# Altium schematic sheet [21] - AUDIO.SchDoc
size A3; DocumentNumber: 21; SheetNumber: 21; SheetTotal: 31
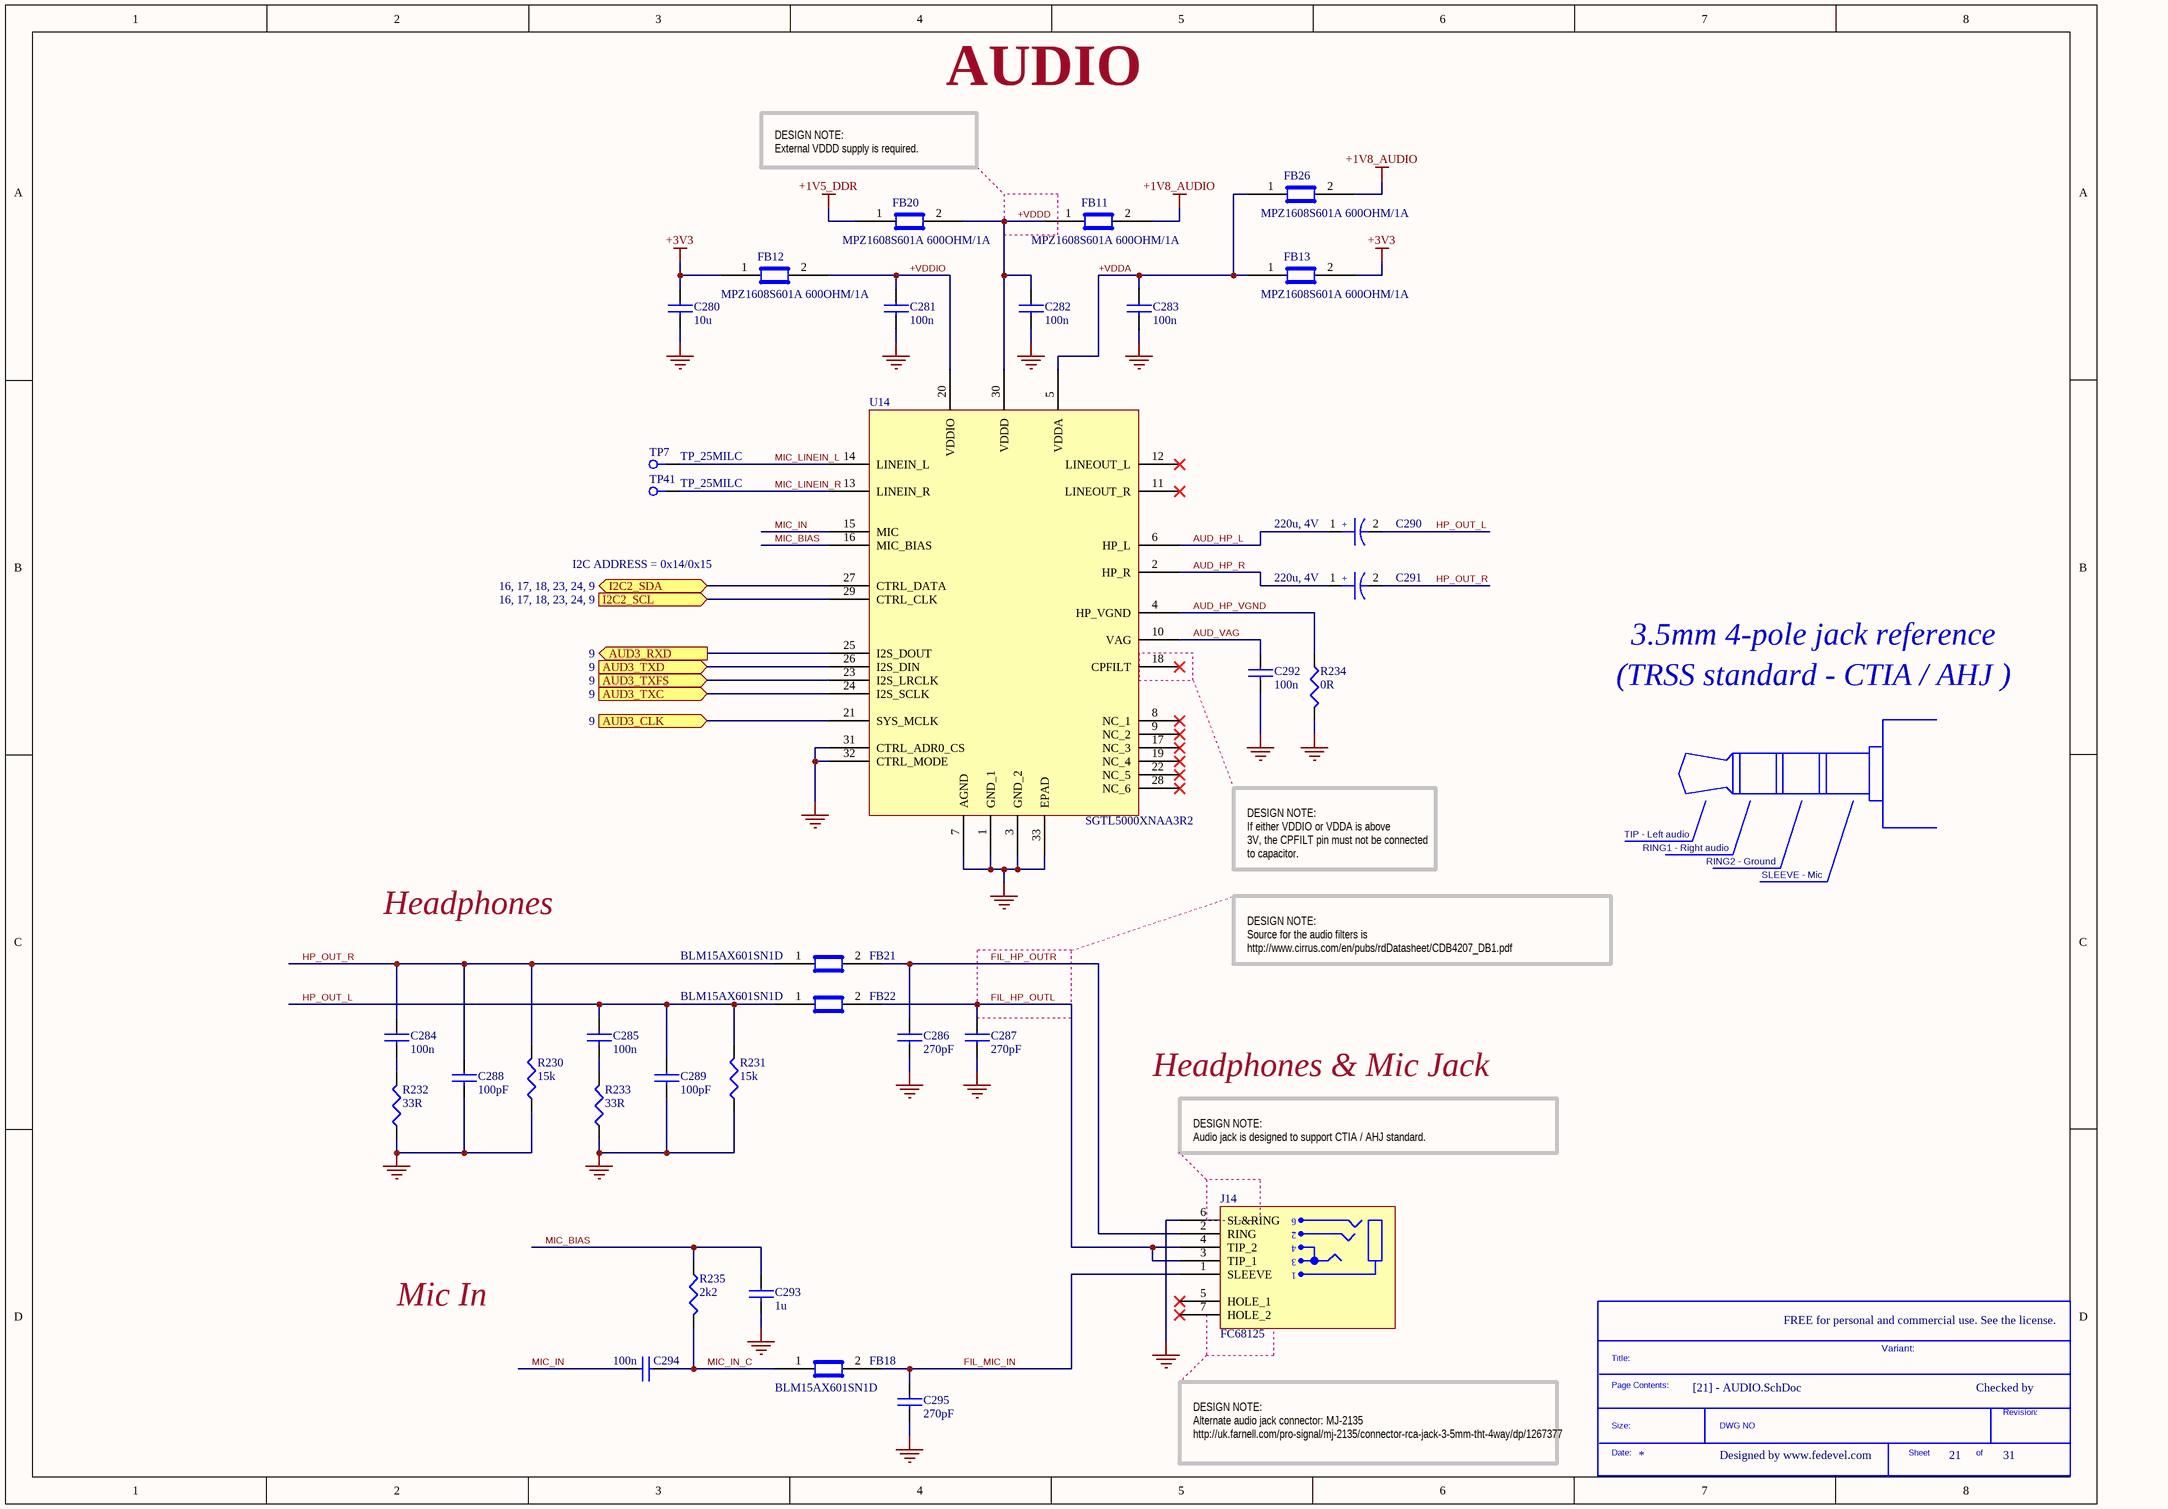
[diagram p0: [21] - AUDIO.SchDoc]

## Parts
*  SDTitleBlock  (value not drawn)  (graphical)
C280  10u  [C0603]
C281  100n  [C0402]
C282  100n  [C0402]
C283  100n  [C0402]
C284  100n  [C0402]
C285  100n  [C0402]
C286  270pF  [C0402]
C287  270pF  [C0402]
C288  100pF  [C0402]
C289  100pF  [C0402]
C290  220u, 4V  [C1206 -  TLN S Case Tantal]
C291  220u, 4V  [C1206 -  TLN S Case Tantal]
C292  100n  [C0402]
C293  1u  [C0402]
C294  100n  [C0402]
C295  270pF  [C0402]
FB11  MPZ1608S601A 600OHM/1A  [C0603]
FB12  MPZ1608S601A 600OHM/1A  [C0603]
FB13  MPZ1608S601A 600OHM/1A  [C0603]
FB18  BLM15AX601SN1D  [C0402]
FB20  MPZ1608S601A 600OHM/1A  [C0603]
FB21  BLM15AX601SN1D  [C0402]
FB22  BLM15AX601SN1D  [C0402]
FB26  MPZ1608S601A 600OHM/1A  [C0603]
J14  FC68125  [FC68125]
R230  15k  [R0402]
R231  15k  [R0402]
R232  33R  [R0402]
R233  33R  [R0402]
R234  0R  [R0402]
R235  2k2  [R0402]
TP7  TP_25MILC  [TP_25C]  (no BOM)
TP41  TP_25MILC  [TP_25C]  (no BOM)
U14  SGTL5000XNAA3R2  [QFN32 5x5x0.85_V1.1]

## Ports
AUD3_CLK (in, see 9), AUD3_RXD (out, see 9), AUD3_TXC (in, see 9), AUD3_TXD (in, see 9), AUD3_TXFS (in, see 9), I2C2_SCL (see 16, 17, 18, 23, 24, 9), I2C2_SDA (bidir, see 16, 17, 18, 23, 24, 9)

## Nets
+1V5_DDR: FB20.1
+1V8_AUDIO: FB11.2 FB26.2
+3V3: C280.1 FB12.1 FB13.2
GND: C280.2 C281.2 C282.2 C283.2 C286.2 C287.2 C288.2 C289.2 C292.2 C293.2 C295.2 J14.6(SL&RING) R230.1 R231.1 R232.1 R233.1 R234.2 U14.1(GND_1) U14.3(GND_2) U14.7(AGND) U14.31(CTRL_ADR0_CS) U14.32(CTRL_MODE) U14.33(EPAD)
+VDDA: C283.1 FB13.1 FB26.1 U14.5(VDDA)
+VDDD: C282.1 FB11.1 FB20.2 U14.30(VDDD)
+VDDIO: C281.1 FB12.2 U14.20(VDDIO)
AUD3_CLK: U14.21(SYS_MCLK) ; port AUD3_CLK
AUD3_RXD: U14.25(I2S_DOUT) ; port AUD3_RXD
AUD3_TXC: U14.24(I2S_SCLK) ; port AUD3_TXC
AUD3_TXD: U14.26(I2S_DIN) ; port AUD3_TXD
AUD3_TXFS: U14.23(I2S_LRCLK) ; port AUD3_TXFS
AUD_HP_L: C290.1 U14.6(HP_L)
AUD_HP_R: C291.1 U14.2(HP_R)
AUD_HP_VGND: R234.1 U14.4(HP_VGND)
AUD_VAG: C292.1 U14.10(VAG)
FIL_HP_OUTL: C287.1 FB22.2 J14.3(TIP_1) J14.4(TIP_2)
FIL_HP_OUTR: C286.1 FB21.2 J14.2(RING)
FIL_MIC_IN: C295.1 FB18.2 J14.1(SLEEVE)
HP_OUT_L: C285.1 C289.1 C290.2 FB22.1 R231.2
HP_OUT_R: C284.1 C288.1 C291.2 FB21.1 R230.2
I2C2_SCL: U14.29(CTRL_CLK) ; port I2C2_SCL
I2C2_SDA: U14.27(CTRL_DATA) ; port I2C2_SDA
MIC_BIAS: C293.1 R235.1 U14.16(MIC_BIAS)
MIC_IN: C294.1 U14.15(MIC)
MIC_IN_C: C294.2 FB18.1 R235.2
MIC_LINEIN_L: TP7.1 U14.14(LINEIN_L)
MIC_LINEIN_R: TP41.1 U14.13(LINEIN_R)
NetC284_2: C284.2 R232.2
NetC285_2: C285.2 R233.2

Not connected (* = marked no-connect by the designer): J14 5(HOLE_1)* 7(HOLE_2)*; U14 8(NC_1)* 9(NC_2)* 11(LINEOUT_R)* 12(LINEOUT_L)* 17(NC_3)* 18(CPFILT)* 19(NC_4)* 22(NC_5)* 28(NC_6)*

## Notes on the sheet
- AUDIO
- DESIGN NOTE:
  External VDDD supply is required.
- I2C ADDRESS = 0x14/0x15
- 3.5mm 4-pole jack reference
- (TRSS standard - CTIA / AHJ )
- TIP - Left audio
- RING1 - Right audio
- RING2 - Ground
- Headphones
- DESIGN NOTE:
  If either VDDIO or VDDA is above
  3V, the CPFILT pin must not be connected to capacitor.
- SLEEVE - Mic
- DESIGN NOTE:
  Source for the audio filters is http://www.cirrus.com/en/pubs/rdDatasheet/CDB4207_DB1.pdf
- Headphones & Mic Jack
- DESIGN NOTE:
  Audio jack is designed to support CTIA / AHJ standard.
- Mic In
- FREE for personal and commercial use. See the license.
- Variant:
- Checked by
- DESIGN NOTE:
  Alternate audio jack connector: MJ-2135
  http://uk.farnell.com/pro-signal/mj-2135/connector-rca-jack-3-5mm-tht-4way/dp/1267377
- Designed by www.fedevel.com
- (in symbol SDTitleBlock) Title:; Page Contents:; Revision:; Size:; DWG NO; Date:; Sheet; of
- (in symbol TLNS227M004R3000) +

## Library data of the parts
C280 = C1608X5R0J106M: CAP CER 10UF 6.3V X5R 20% 0603; Manufacturer: TDK Corporation; Capacitance: 10µF; Value: 10µF; .Checked PCB: used; Category: Capacitors; Supplier Part Number: 445-4112-1-ND; Manufacturer Part Number: C1608X5R0J106M; Operating Temperature: -55°C ~ 85°C; Package / Case: 0603 (1608 Metric); Price 1k [$]: 0.08580; .Checked SCH: used; Voltage - Rated: 6.3V; Features: Low ESR; Supplier: Digikey; Supplier 1: Digi-Key; Supplier Part Number 1: 445-4112-1-ND; RoHS: RoHS Compliant; Stock 1: 48157; Pricing 1: 1=0.46, 10=0.363, 100=0.1898, 250=0.14024, 500=0.1089, 1000=0.0858 (USD); Tolerance: ±20%; Temperature Coefficient: X5R; Mounting Type: Surface Mount, MLCC; Applications: General Purpose; Ratings: -; Size / Dimension: 0.063" L x 0.031" W (1.60mm x 0.80mm); Height - Seated (Max): -; Thickness (Max): 0.037" (0.95mm); Lead Spacing: -; Packaging: Cut Tape (CT); Lead Style: -; ComponentLink1URL: http://www.tdk.com/pdf/general_B11.pdf; ComponentLink1Description: http://www.tdk.com/pdf/general_B11.pdf
C281-C285 C292 C294 = C1005X5R1H104K: CAP CER .10UF 50V X5R 10% 0402; Manufacturer: TDK Corporation; Capacitance: 0.1µF; Value: 100nF; .Checked PCB: used; Category: Capacitors; Supplier Part Number: 445-5942-1-ND; Manufacturer Part Number: C1005X5R1H104K; Operating Temperature: -55°C ~ 85°C; Package / Case: 0402 (1005 Metric); Price 1k [$]: 0.02340; .Checked SCH: used; Voltage - Rated: 50V; Supplier: Digikey; Supplier 1: Digi-Key; Supplier Part Number 1: 445-5942-1-ND; RoHS: RoHS Compliant; Stock 1: 106926; Pricing 1: 1=0.27, 10=0.18, 100=0.072, 250=0.05176, 500=0.0369, 1000=0.027 (USD); Tolerance: ±10%; Temperature Coefficient: X5R; Mounting Type: Surface Mount, MLCC; Applications: General Purpose; Ratings: -; Size / Dimension: 0.039" L x 0.020" W (1.00mm x 0.50mm); Height - Seated (Max): -; Thickness (Max): 0.022" (0.55mm); Lead Spacing: -; Features: -; Packaging: Cut Tape (CT); Lead Style: -; ComponentLink1URL: http://www.tdk.co.jp/tefe02/e412_c.pdf; ComponentLink1Description: http://www.tdk.co.jp/tefe02/e412_c.pdf
C286 C287 C295 = GRM155R71H271KA01D: CAP CER 270PF 50V 10% X7R 0402; Manufacturer: Murata Electronics North America; .Checked PCB: used; Supplier 1: Digi-Key; Supplier Part Number 1: 490-1299-1-ND; Manufacturer Part Number: GRM155R71H271KA01D; RoHS: RoHS Compliant; Category: Capacitors; Stock 1: 83894; Pricing 1: 10=0.032, 50=0.0252, 100=0.0189, 250=0.01364, 500=0.01008, 1000=0.00683, 5000=0.00525 (USD); Capacitance: 270pF; Voltage - Rated: 50V; Tolerance: ±10%; Temperature Coefficient: X7R; Mounting Type: Surface Mount, MLCC; Operating Temperature: -55°C ~ 125°C; Applications: General Purpose; Ratings: -; Package / Case: 0402 (1005 Metric); Size / Dimension: 0.039" L x 0.020" W (1.00mm x 0.50mm); Height - Seated (Max): -; Thickness (Max): 0.022" (0.55mm); Lead Spacing: -; Features: -; Packaging: Cut Tape (CT); Lead Style: -; ComponentLink1URL: http://search.murata.co.jp/Ceramy/image/img/PDF/ENG/GRM155R71H271KA01.pdf; ComponentLink1Description: http://search.murata.co.jp/Ceramy/image/img/PDF/ENG/GRM155R71H271KA01.pdf; .Checked SCH: used
C288 C289 = C1005C0G1H101J: CAP CER 100PF 50V 5% NP0 0402; Manufacturer: TDK Corporation; Temperature Coefficient: C0G, NP0; .Checked PCB: used; Supplier 1: Digi-Key; Supplier Part Number 1: 445-1247-1-ND; Manufacturer Part Number: C1005C0G1H101J; RoHS: RoHS Compliant; Category: Capacitors; Stock 1: 298233; Pricing 1: 1=0.08, 10=0.05, 100=0.018, 250=0.013, 500=0.0096, 1000=0.0065 (USD); Capacitance: 100pF; Voltage - Rated: 50V; Tolerance: ±5%; Mounting Type: Surface Mount, MLCC; Operating Temperature: -55°C ~ 125°C; Applications: General Purpose; Ratings: -; Package / Case: 0402 (1005 Metric); Size / Dimension: 0.039" L x 0.020" W (1.00mm x 0.50mm); Height - Seated (Max): -; Thickness (Max): 0.022" (0.55mm); Lead Spacing: -; Features: -; Packaging: Cut Tape (CT); Lead Style: -; ComponentLink1URL: http://www.tdk.com/pdf/general_B11.pdf; ComponentLink1Description: http://www.tdk.com/pdf/general_B11.pdf; .Checked SCH: used
C290 C291 = TLNS227M004R3000: CAP TANT 220UF 4V 20% 1206; Manufacturer: AVX Corporation; Manufacturer Size Code: S; Capacitance: 220µF; ESR (Equivalent Series Resistance): 3.000 Ohm; Type: Molded; .Checked PCB: used; Supplier 1: Digi-Key; Supplier Part Number 1: 478-5526-1-ND; Manufacturer Part Number: TLNS227M004R3000; RoHS: RoHS Compliant; Category: Capacitors; Stock 1: 21393; Pricing 1: 1=1.35, 10=1.128, 100=0.72, 250=0.6, 500=0.54, 1000=0.492 (USD); Voltage - Rated: 4V; Tolerance: ±20%; Operating Temperature: -55°C ~ 125°C; Mounting Type: Surface Mount; Package / Case: 1206 (3216 Metric); Size / Dimension: 0.126" L x 0.063" W (3.20mm x 1.60mm); Height - Seated (Max): 0.047" (1.20mm); Lead Spacing: -; Features: General Purpose; Packaging: Cut Tape (CT); Lifetime @ Temp.: -; ComponentLink1URL: http://www.avx.com/docs/Catalogs/tlnunder.pdf; ComponentLink1Description: http://www.avx.com/docs/Catalogs/tlnunder.pdf; .Checked SCH: used
C293 = C1005X5R1C105K: CAP CER 1.0UF 16V X5R 0402; Manufacturer: TDK Corporation; Capacitance: 1.0µF; Value: 1uF; .Checked PCB: used; Tolerance: ±10%; Category: Capacitors; Supplier Part Number: 445-4978-1-ND; Manufacturer Part Number: C1005X5R1C105K; Operating Temperature: -55°C ~ 85°C; Package / Case: 0402 (1005 Metric); Price 1k [$]: 0.02080; .Checked SCH: used; Voltage - Rated: 16V; Supplier: Digikey; Supplier 1: Digi-Key; Supplier Part Number 1: 445-4978-1-ND; RoHS: RoHS Compliant; Stock 1: 341010; Pricing 1: 1=0.24, 10=0.16, 100=0.064, 250=0.046, 500=0.0328, 1000=0.024 (USD); Temperature Coefficient: X5R; Mounting Type: Surface Mount, MLCC; Applications: General Purpose; Ratings: -; Size / Dimension: 0.039" L x 0.020" W (1.00mm x 0.50mm); Height - Seated (Max): -; Thickness (Max): 0.022" (0.55mm); Lead Spacing: -; Features: -; Packaging: Cut Tape (CT); Lead Style: -; ComponentLink1URL: http://www.tdk.co.jp/tefe02/e412_c.pdf; ComponentLink1Description: http://www.tdk.co.jp/tefe02/e412_c.pdf
FB11-FB13 FB20 FB26 = MPZ1608S601A: FERRITE CHIP BEAD 600 OHM SMD 1A; Manufacturer: TDK Corporation; Impedance @ Frequency: 600 Ohm @ 100MHz; DC Resistance (DCR): 150 mOhm Max; Filter Type: Differential Mode - Single; Number of Lines: 1; .Checked PCB: used; Supplier 1: Digi-Key; Supplier Part Number 1: 445-2205-1-ND; Manufacturer Part Number: MPZ1608S601A; RoHS: RoHS Compliant; Category: Filters; Stock 1: 328345; Pricing 1: 1=0.36, 10=0.24, 100=0.096, 250=0.069, 500=0.0492, 1000=0.036 (USD); Current Rating: 1A; Package / Case: 0603 (1608 Metric); Mounting Type: Surface Mount; Packaging: Cut Tape (CT); Height (Max): 0.037" (0.95mm); Size / Dimension: 0.063" L x 0.031" W (1.60mm x 0.80mm); ComponentLink1URL: http://www.tdk.co.jp/tefe02/e9413_mpz.pdf; ComponentLink1Description: http://www.tdk.co.jp/tefe02/e9413_mpz.pdf; .Checked SCH: used
FB18 FB21 FB22 = BLM15AX601SN1D: FERRITE CHIP 600 OHM 0402 420mA; Manufacturer: Murata Electronics North America; .Checked PCB: used; Impedance @ Frequency: 600 Ohm @ 100MHz; DC Resistance (DCR): 340 mOhm Max; Filter Type: Differential Mode - Single; Number of Lines: 1; .Checked SCH: used; Category: Filters; Manufacturer Part Number: BLM15AX601SN1D; Package / Case: 0402 (1005 Metric); Current Rating: 420mA; Supplier 1: Digi-Key; Supplier Part Number 1: 490-5441-1-ND; RoHS: RoHS Compliant; Stock 1: 34008; Pricing 1: 1=0.26, 10=0.197, 50=0.1148, 100=0.0918, 250=0.0656, 500=0.0446, 1000=0.03608, 5000=0.02821 (USD); Mounting Type: Surface Mount; Packaging: Cut Tape (CT); Height (Max): 0.022" (0.55mm); Size / Dimension: 0.039" L x 0.020" W (1.00mm x 0.50mm); ComponentLink1URL: http://search.murata.co.jp/Ceramy/image/img/PDF/ENG/L0110S0100BLM15AX_SN.pdf; ComponentLink1Description: http://search.murata.co.jp/Ceramy/image/img/PDF/ENG/L0110S0100BLM15AX_SN.pdf; Supplier Part Number: 490-5441-1-ND; Price 1k [$]: 0.03280; Value: BLM15AX601SN1D; Supplier: Digikey
J14 = FC68125: CLIFF ELECTRONIC COMPONENTS - FC68125 - CONNECTOR, PHONO, 3.5MM, JACK, 4POLE; .Creator: MM; Supplier 1: Farnell; Manufacturer: CLIFF ELECTRONIC COMPONENTS; Manufacturer Part Number: FC68125; RoHS: YES; Stock 1: 5095; Pricing 1: 1=1.18, 10=0.652, 25=0.505, 50=0.433, 100=0.371, 500=0.316 (GBP); ComponentLink1URL: http://www.farnell.com/cad/1803251.pdf; ComponentLink1Description: http://www.farnell.com/cad/1803251.pdf; ComponentLink2URL: http://www.farnell.com/datasheets/1759063.pdf; ComponentLink2Description: http://www.farnell.com/datasheets/1759063.pdf; Supplier Part Number 1: 2309468; Category: Connectors, Interconnects; .Checked PCB: MM; .Checked SCH: MM
R230 R231 = RC0402FR-0715KL: RES 15.0K OHM 1/16W 1% 0402 SMD; Manufacturer: Yageo; Power (Watts): 0.063W, 1/16W; .Checked PCB: used; Temperature Coefficient: ±100ppm/°C; Category: Resistors; Supplier Part Number: 311-15.0KLRCT-ND; Manufacturer Part Number: RC0402FR-0715KL; Package / Case: 0402 (1005 Metric); Price 1k [$]: 0.01421; Resistance (Ohms): 15K; Tolerance: ±1%; Value: 15k; .Checked SCH: used; Supplier: Digikey; Supplier 1: Digi-Key; Supplier Part Number 1: 311-15.0KLRCT-ND; RoHS: RoHS Compliant; Stock 1: 31992; Pricing 1: 10=0.014, 50=0.0104, 100=0.0079, 250=0.00584, 500=0.00432, 1000=0.00288 (USD); Composition: Thick Film; Features: -; Size / Dimension: 0.039" L x 0.020" W (1.00mm x 0.50mm); Height: 0.016" (0.40mm); Number of Terminations: 2; Packaging: Cut Tape (CT); ComponentLink1URL: http://www.yageo.com/documents/recent/PYu-RC0402_51_RoHS_L_6.pdf; ComponentLink1Description: http://www.yageo.com/documents/recent/PYu-RC0402_51_RoHS_L_6.pdf
R232 R233 = RMCF0402FT33R0: RES TF 33 OHM 1% 1/16W 0402; Manufacturer: Stackpole Electronics Inc; Resistance (Ohms): 33; Power (Watts): 0.063W, 1/16W; .Checked PCB: used; Temperature Coefficient: ±100ppm/°C; Category: Resistors; Supplier Part Number: RMCF0402FT33R0CT-ND; Manufacturer Part Number: RMCF0402FT33R0; Package / Case: 0402 (1005 Metric); Price 1k [$]: 0.00384; Tolerance: ±1%; Value: 33R; .Checked SCH: used; Supplier: Digikey; Supplier 1: Digi-Key; Supplier Part Number 1: RMCF0402FT33R0CT-ND; RoHS: RoHS Compliant; Stock 1: 26866; Pricing 1: 1=0.04, 10=0.025, 50=0.0138, 100=0.0105, 250=0.0078, 500=0.00576, 1000=0.00384 (USD); Composition: Thick Film; Features: -; Size / Dimension: 0.039" L x 0.020" W (1.00mm x 0.50mm); Height: 0.016" (0.40mm); Number of Terminations: 2; Packaging: Cut Tape (CT); ComponentLink1URL: http://www.seielect.com/Catalog/SEI-RMCF.pdf; ComponentLink1Description: http://www.seielect.com/Catalog/SEI-RMCF.pdf
R234 = RC0402JR-070RL: RES 0.0 OHM 1/16W 0402 SMD; Manufacturer: Yageo; Resistance (Ohms): 0.0; Power (Watts): 0.063W, 1/16W; Tolerance: Jumper; .Checked PCB: used; Category: Resistors; Supplier Part Number: 311-0.0JRCT-ND; Manufacturer Part Number: RC0402JR-070RL; Package / Case: 0402 (1005 Metric); Price 1k [$]: 0.01389; Value: 0R; .Checked SCH: used; Supplier: Digikey; Supplier 1: Digi-Key; Supplier Part Number 1: 311-0.0JRCT-ND; RoHS: RoHS Compliant; Stock 1: 1106330; Pricing 1: 10=0.012, 50=0.009, 100=0.0069, 250=0.00512, 500=0.0038, 1000=0.00253 (USD); Composition: Thick Film; Features: -; Temperature Coefficient: -; Size / Dimension: 0.039" L x 0.020" W (1.00mm x 0.50mm); Height: 0.016" (0.40mm); Number of Terminations: 2; Packaging: Cut Tape (CT); ComponentLink1URL: http://www.yageo.com/documents/recent/PYu-RC0402_51_RoHS_L_6.pdf; ComponentLink1Description: http://www.yageo.com/documents/recent/PYu-RC0402_51_RoHS_L_6.pdf
R235 = RC0402FR-072K2L: RES 2.20K OHM 1/16W 1% 0402 SMD; Manufacturer: Yageo; Resistance (Ohms): 2.2K; Power (Watts): 0.063W, 1/16W; .Checked PCB: used; Temperature Coefficient: ±100ppm/°C; Category: Resistors; Supplier Part Number: 311-2.20KLRCT-ND; Manufacturer Part Number: RC0402FR-072K2L; Package / Case: 0402 (1005 Metric); Price 1k [$]: 0.01421; Tolerance: ±1%; Value: 2k2; .Checked SCH: used; Supplier: Digikey; Supplier 1: Digi-Key; Supplier Part Number 1: 311-2.20KLRCT-ND; RoHS: RoHS Compliant; Stock 1: 195154; Pricing 1: 10=0.014, 50=0.0104, 100=0.0079, 250=0.00584, 500=0.00432, 1000=0.00288 (USD); Composition: Thick Film; Features: -; Size / Dimension: 0.039" L x 0.020" W (1.00mm x 0.50mm); Height: 0.016" (0.40mm); Number of Terminations: 2; Packaging: Cut Tape (CT); ComponentLink1URL: http://www.yageo.com/documents/recent/PYu-RC0402_51_RoHS_L_6.pdf; ComponentLink1Description: http://www.yageo.com/documents/recent/PYu-RC0402_51_RoHS_L_6.pdf
TP7 TP41 = TP_25MILC: Test Point 25mil
U14 = SGTL5000XNAA3R2: IC AUDIO CODEC STEREO 32-QFN; Manufacturer: Freescale Semiconductor; Data Interface: I²C, Serial, SPI™; Number of ADCs / DACs: 1 / 1; Sigma Delta: No; S/N Ratio, ADCs / DACs (db) Typ: 90 / 100; Voltage - Supply, Analog: 1.62 V ~ 3.6 V; Voltage - Supply, Digital: 1.1 V ~ 2 V, 1.62 V ~ 3.6 V; .Creator: MM; .Checked PCB: used; Supplier 1: Digi-Key; Manufacturer Part Number: SGTL5000XNAA3R2; RoHS: RoHS Compliant; Category: Integrated Circuits (ICs); Stock 1: 0; Pricing 1: 1=2.66, 10=2.375, 25=2.2324, 100=2.1375, 250=2.04252, 500=1.9, 1000=1.8525 (USD); Packaging: Cut Tape (CT); Type: Stereo Audio; Resolution (Bits): -; Dynamic Range, ADCs / DACs (db) Typ: -; Operating Temperature: -40°C ~ 85°C; Mounting Type: Surface Mount; Package / Case: 32-VFQFN Exposed Pad; Supplier Device Package: 32-QFN Exposed Pad (5x5); ComponentLink1URL: http://cache.freescale.com/files/analog/doc/data_sheet/SGTL5000.pdf; ComponentLink1Description: http://cache.freescale.com/files/analog/doc/data_sheet/SGTL5000.pdf; Supplier Part Number 1: SGTL5000XNAA3R2CT-ND; .Checked SCH: used